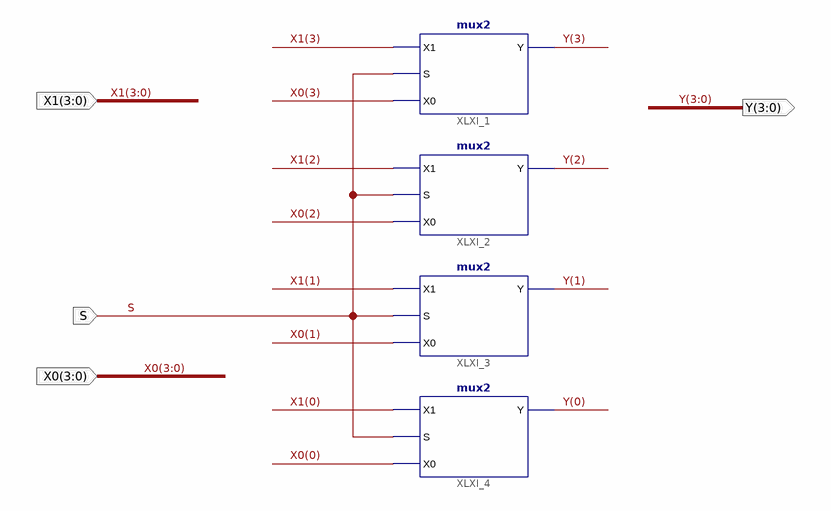
[diagram p0: schematic sheet 1]
// Xilinx ISE schematic mux4.sch (spartan3e) as structural Verilog: 4 symbols, 4 ports
module mux4 (
  input  [3:0] X0,
  input  [3:0] X1,
  input  S,
  output [3:0] Y
);

  mux2 XLXI_1 (.S(S), .X0(X0[3]), .X1(X1[3]), .Y(Y[3]));
  mux2 XLXI_2 (.S(S), .X0(X0[2]), .X1(X1[2]), .Y(Y[2]));
  mux2 XLXI_3 (.S(S), .X0(X0[1]), .X1(X1[1]), .Y(Y[1]));
  mux2 XLXI_4 (.S(S), .X0(X0[0]), .X1(X1[0]), .Y(Y[0]));
endmodule
